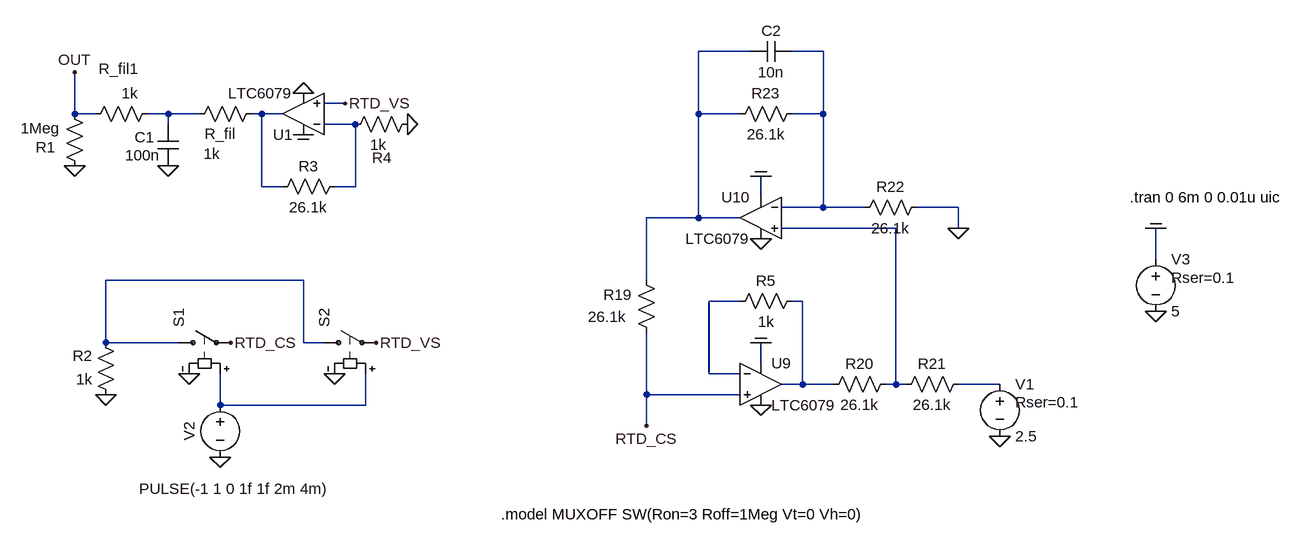
[diagram p0: schematic PT1000_SunS_inrush_and_trans_time.asc]
PT1000_SunS_inrush_and_trans_time.asc, the LTspice schematic file:
Version 4
SHEET 1 1252 1040
WIRE -256 -1104 -336 -1104
WIRE -144 -1104 -192 -1104
WIRE -880 -1024 -912 -1024
WIRE -1296 -1008 -1296 -1072
WIRE -1264 -1008 -1296 -1008
WIRE -1152 -1008 -1184 -1008
WIRE -1104 -1008 -1152 -1008
WIRE -1008 -1008 -1024 -1008
WIRE -976 -1008 -1008 -1008
WIRE -336 -1008 -336 -1104
WIRE -272 -1008 -336 -1008
WIRE -144 -1008 -144 -1104
WIRE -144 -1008 -192 -1008
WIRE -1152 -992 -1152 -1008
WIRE -864 -992 -912 -992
WIRE -1008 -896 -1008 -1008
WIRE -976 -896 -1008 -896
WIRE -864 -896 -864 -992
WIRE -864 -896 -896 -896
WIRE -240 -880 -240 -912
WIRE -144 -864 -144 -1008
WIRE -144 -864 -208 -864
WIRE -80 -864 -144 -864
WIRE 64 -864 0 -864
WIRE -336 -848 -336 -1008
WIRE -336 -848 -416 -848
WIRE -272 -848 -336 -848
WIRE -32 -832 -208 -832
WIRE 64 -832 64 -864
WIRE 368 -784 368 -832
WIRE -944 -752 -1248 -752
WIRE -416 -752 -416 -848
WIRE -272 -720 -320 -720
WIRE -176 -720 -192 -720
WIRE -1248 -656 -1248 -752
WIRE -1136 -656 -1248 -656
WIRE -944 -656 -944 -752
WIRE -912 -656 -944 -656
WIRE -240 -624 -240 -656
WIRE -320 -608 -320 -720
WIRE -272 -608 -320 -608
WIRE -176 -592 -176 -720
WIRE -176 -592 -208 -592
WIRE -128 -592 -176 -592
WIRE -32 -592 -32 -832
WIRE -32 -592 -48 -592
WIRE -16 -592 -32 -592
WIRE 128 -592 64 -592
WIRE -416 -576 -416 -672
WIRE -272 -576 -416 -576
WIRE -1072 -560 -1072 -608
WIRE -848 -560 -848 -608
WIRE -848 -560 -1072 -560
WIRE -416 -528 -416 -576
FLAG 368 -704 0
FLAG 368 -832 COM
FLAG -240 -560 0
FLAG -240 -816 0
FLAG -240 -656 COM
FLAG -240 -912 COM
FLAG 64 -832 0
FLAG 128 -512 0
FLAG -1248 -576 0
FLAG -1296 -928 0
FLAG -1296 -1072 OUT
FLAG -944 -976 COM
FLAG -944 -1040 0
FLAG -1152 -928 0
FLAG -416 -528 RTD_CS
FLAG -1120 -608 0
FLAG -1072 -480 0
FLAG -1056 -656 RTD_CS
FLAG -896 -608 0
FLAG -832 -656 RTD_VS
FLAG -880 -1024 RTD_VS
FLAG -784 -992 0
SYMBOL voltage 368 -800 R0
WINDOW 123 0 0 Left 2
WINDOW 39 24 44 Left 2
SYMATTR SpiceLine Rser=0.1
SYMATTR InstName V3
SYMATTR Value 5
SYMBOL Opamps\\LTC6079 -240 -592 R0
SYMATTR InstName U9
SYMBOL Opamps\\LTC6079 -240 -848 M0
SYMATTR InstName U10
SYMBOL res -432 -768 R0
WINDOW 0 -50 38 Left 2
WINDOW 3 -74 72 Left 2
SYMATTR InstName R19
SYMATTR Value 26.1k
SYMATTR SpiceLine tol=0.1
SYMBOL res -32 -608 R90
WINDOW 0 0 56 VBottom 2
WINDOW 3 32 56 VTop 2
SYMATTR InstName R20
SYMATTR Value 26.1k
SYMATTR SpiceLine tol=0.1
SYMBOL res 80 -608 R90
WINDOW 0 0 56 VBottom 2
WINDOW 3 32 56 VTop 2
SYMATTR InstName R21
SYMATTR Value 26.1k
SYMATTR SpiceLine tol=0.1
SYMBOL res 16 -880 R90
WINDOW 0 0 56 VBottom 2
WINDOW 3 32 56 VTop 2
SYMATTR InstName R22
SYMATTR Value 26.1k
SYMATTR SpiceLine tol=0.1
SYMBOL res -176 -1024 R90
WINDOW 0 0 56 VBottom 2
WINDOW 3 32 56 VTop 2
SYMATTR InstName R23
SYMATTR Value 26.1k
SYMATTR SpiceLine tol=0.1
SYMBOL voltage 128 -608 R0
WINDOW 123 0 0 Left 2
WINDOW 39 24 44 Left 2
SYMATTR SpiceLine Rser=0.1
SYMATTR InstName V1
SYMATTR Value 2.5
SYMBOL res -1312 -1024 R0
WINDOW 0 -44 67 Left 2
WINDOW 3 -67 38 Left 2
SYMATTR InstName R1
SYMATTR Value 1Meg
SYMBOL Opamps\\LTC6079 -944 -1008 R180
SYMATTR InstName U1
SYMBOL cap -1168 -992 R0
WINDOW 0 -36 20 Left 2
WINDOW 3 -50 48 Left 2
SYMATTR InstName C1
SYMATTR Value 100n
SYMBOL res -1008 -1024 R90
WINDOW 0 62 64 VBottom 2
WINDOW 3 62 77 VTop 2
SYMATTR InstName R_fil
SYMATTR Value 1k
SYMBOL sw -1152 -656 R270
SYMATTR InstName S1
SYMATTR Value ""
SYMATTR SpiceModel MUXOFF
SYMBOL voltage -1072 -576 R0
WINDOW 0 -32 56 VBottom 2
WINDOW 3 21 129 Top 2
WINDOW 123 0 0 Left 2
WINDOW 39 0 0 Left 2
SYMATTR InstName V2
SYMATTR Value PULSE(-1 1 0 1f 1f 2m 4m)
SYMBOL res -1232 -560 R180
WINDOW 0 36 76 Left 2
WINDOW 3 36 40 Left 2
SYMATTR InstName R2
SYMATTR Value 1k
SYMBOL res -880 -912 R90
WINDOW 0 0 56 VBottom 2
WINDOW 3 32 56 VTop 2
SYMATTR InstName R3
SYMATTR Value 26.1k
SYMATTR SpiceLine tol=0.1
SYMBOL res -768 -1008 R90
WINDOW 0 83 55 VBottom 2
WINDOW 3 32 61 VTop 2
SYMATTR InstName R4
SYMATTR Value 1k
SYMATTR SpiceLine tol=0.1
SYMBOL res -1168 -1024 R90
WINDOW 0 -38 60 VBottom 2
WINDOW 3 -31 43 VTop 2
SYMATTR InstName R_fil1
SYMATTR Value 1k
SYMBOL res -176 -736 R90
WINDOW 0 0 56 VBottom 2
WINDOW 3 32 56 VTop 2
SYMATTR InstName R5
SYMATTR Value 1k
SYMATTR SpiceLine tol=0.1
SYMBOL cap -192 -1120 R90
WINDOW 0 0 32 VBottom 2
WINDOW 3 32 32 VTop 2
SYMATTR InstName C2
SYMATTR Value 10n
SYMBOL sw -928 -656 R270
SYMATTR InstName S2
SYMATTR Value ""
SYMATTR SpiceModel MUXOFF
TEXT 328 -880 Left 2 !.tran 0 6m 0 0.01u uic
TEXT -640 -392 Left 2 !.model MUXOFF SW(Ron=3 Roff=1Meg Vt=0 Vh=0)

The netlist it stands for:
* PT1000_SunS_inrush_and_trans_time.asc
V3 COM 0 5 Rser=0.1
XU9 RTD_CS N008 COM 0 N009 LTC6078  ; LTC6079, pins In+ In- V+ V- OUT
XU10 N006 N002 COM 0 N001 LTC6078  ; LTC6079, pins In+ In- V+ V- OUT
R19 N001 RTD_CS 26.1k tol=0.1
R20 N006 N009 26.1k tol=0.1
R21 N010 N006 26.1k tol=0.1
R22 0 N002 26.1k tol=0.1
R23 N002 N001 26.1k tol=0.1
V1 N010 0 2.5 Rser=0.1
R1 OUT 0 1Meg
XU1 RTD_VS N005 COM 0 N004 LTC6078  ; LTC6079, pins In+ In- V+ V- OUT
C1 N003 0 100n
R_fil N004 N003 1k
S1 N007 RTD_CS N011 0 MUXOFF
V2 N011 0 PULSE(-1 1 0 1f 1f 2m 4m)
R2 0 N007 1k
R3 N005 N004 26.1k tol=0.1
R4 0 N005 1k tol=0.1
R_fil1 N003 OUT 1k
R5 N009 N008 1k tol=0.1
C2 N002 N001 10n
S2 N007 RTD_VS N011 0 MUXOFF
.tran 0 6m 0 0.01u uic
.model MUXOFF SW(Ron=3 Roff=1Meg Vt=0 Vh=0)
.lib LTC5.lib
.backanno
.end

* Results of the author's LTspice run, read from the files saved beside the schematic
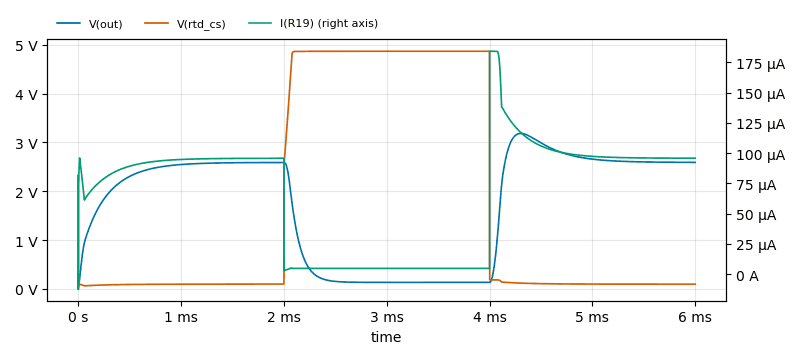
[diagram p1: Transient Analysis of PT1000_SunS_inrush_and_trans_time.asc, plotted from the saved traces]
* Transient Analysis, 1 run:
*   V(out): min 0 V, max 3.185 V, average 1.749 V, rms 2.089 V, last 2.592 V
*   V(rtd_cs): min 0 V, max 4.87 V, average 1.673 V, rms 2.789 V, last 96.11 mV
*   I(R19): min -12.03 µA, max 184.1 µA, average 67.32 µA, rms 81.77 µA, last 95.82 µA